# EAGLE design xyControl (EAGLE 6.3)
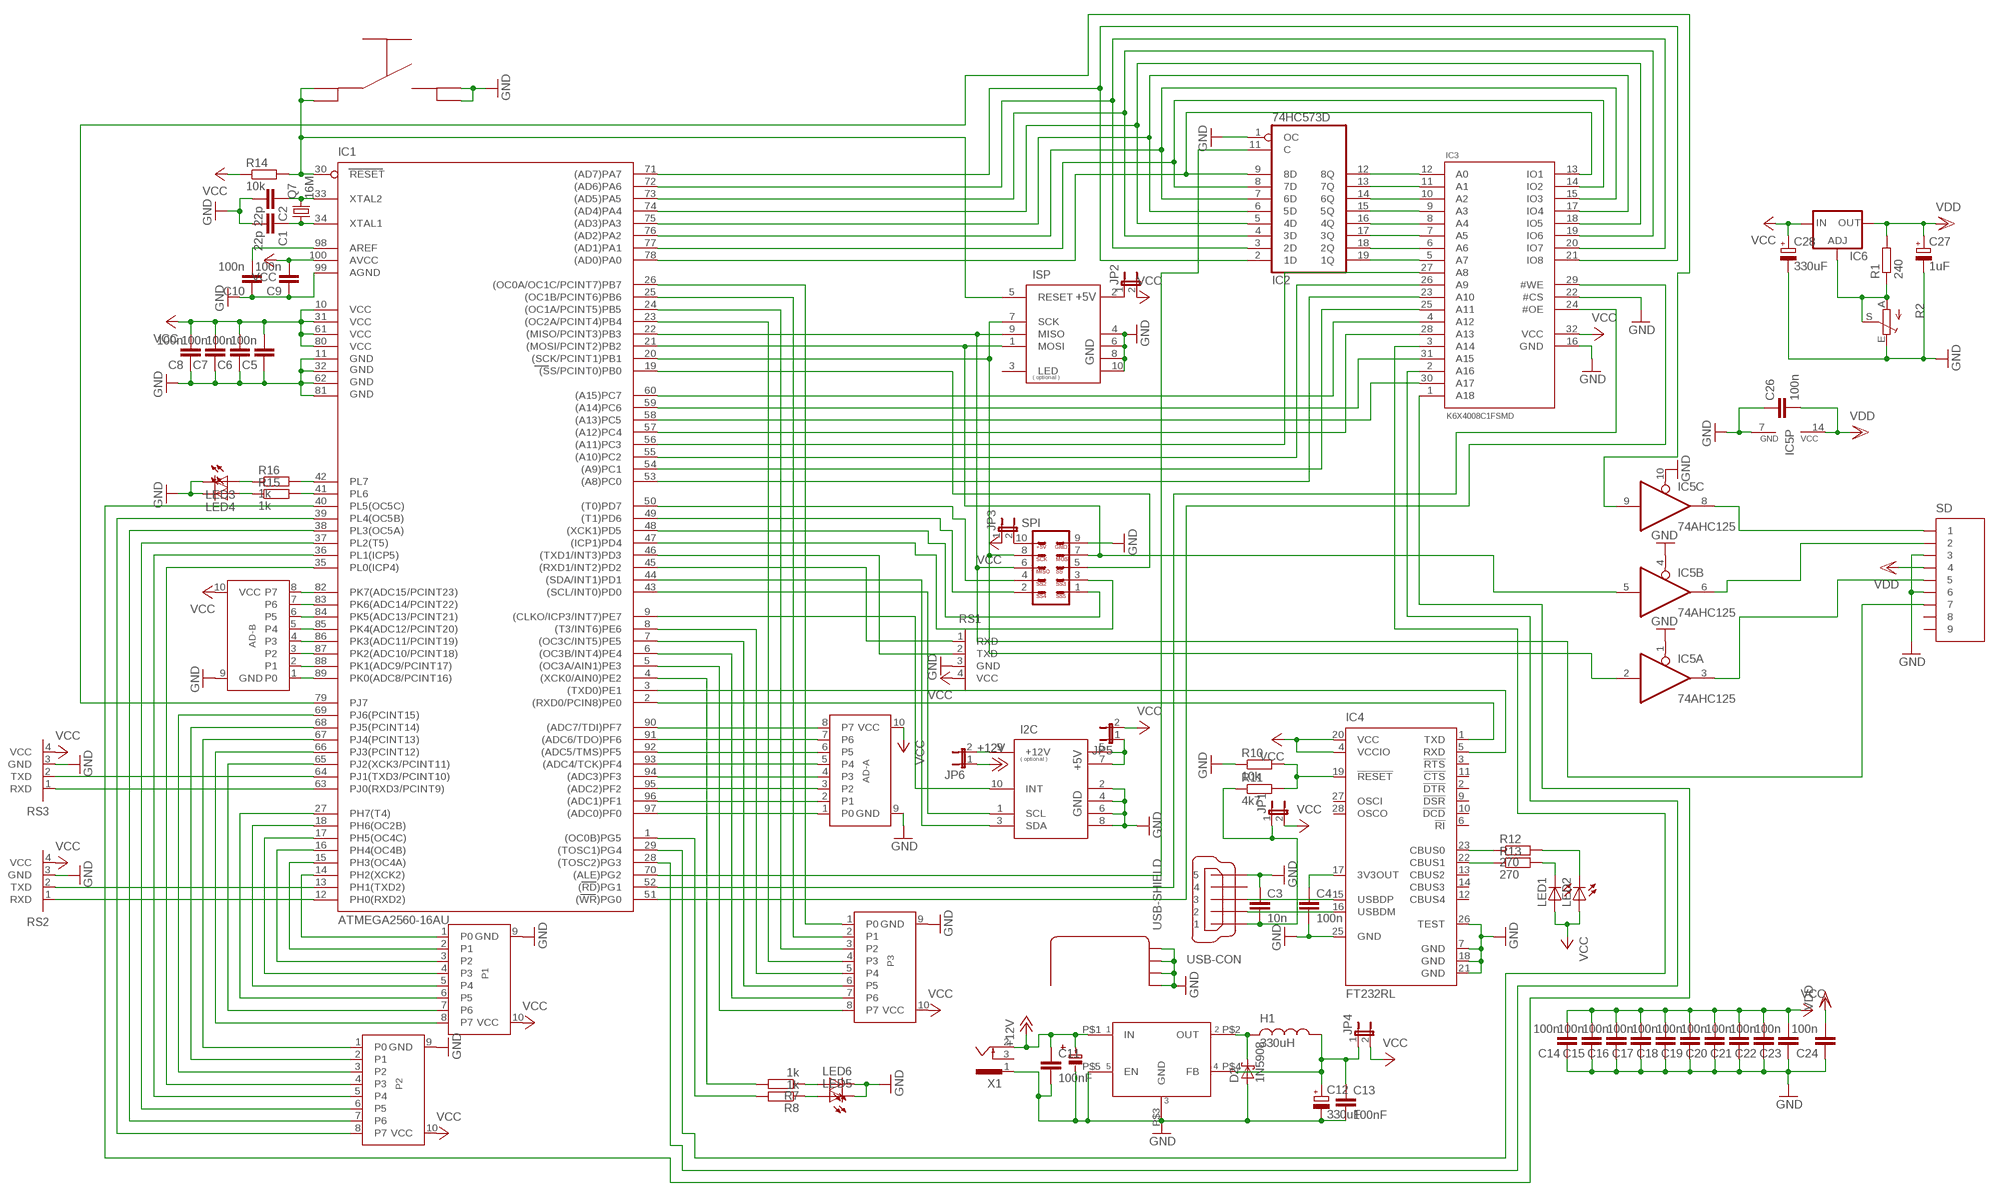
[diagram p0: schematic, sheet 1]

## Parts
AD-A  PORT  [ML10]
AD-B  PORT  [ML10]
C1  22p  C-EUC0603K  [C0603K]
C2  22p  C-EUC0603K  [C0603K]
C3  10n  C-EUC0603K  [C0603K]
C4  100n  C-EUC0603K  [C0603K]
C5  100n  C-EUC0603K  [C0603K]
C6  100n  C-EUC0603K  [C0603K]
C7  100n  C-EUC0603K  [C0603K]
C8  100n  C-EUC0603K  [C0603K]
C9  100n  C-EUC0603K  [C0603K]
C10  100n  C-EUC0603K  [C0603K]
C11  100nF  C-EUC0603K  [C0603K]
C12  330uF  CPOL-EUF  [PANASONIC_F]
C13  100nF  C-EUC0603K  [C0603K]
C14  100n  C-EUC0603K  [C0603K]
C15  100n  C-EUC0603K  [C0603K]
C16  100n  C-EUC0603K  [C0603K]
C17  100n  C-EUC0603K  [C0603K]
C18  100n  C-EUC0603K  [C0603K]
C19  100n  C-EUC0603K  [C0603K]
C20  100n  C-EUC0603K  [C0603K]
C21  100n  C-EUC0603K  [C0603K]
C22  100n  C-EUC0603K  [C0603K]
C23  100n  C-EUC0603K  [C0603K]
C24  100n  C-EUC0603K  [C0603K]
C25  100uF  ELKO  [ELKO_SMD_6.5]
C26  100n  C-EUC0603K  [C0603K]
C27  1uF  CPOL-EUE2.5-6  [E2,5-6]
C28  330uF  CPOL-EUE5-10.5  [E5-10,5]
D2  1N5908  [C4111-15]
H1  330uH  PISR_SPULE  [PISR]
I2C  I2C  [ML10]
IC1  ATMEGA2560-16AU  [TQFP100]
IC2  74HC573D  [SO20W]
IC3  K6X4008C1FSMD  [SOP-32]
IC4  FT232RL  [SSOP28]
IC5  74AHC125  74HC125D  [SO14]
IC6  LM317L  [317L]
ISP  AVR-ISP  [ML10]
JP1  JP1E  [JP1]
JP2  JP1E  [JP1]
JP3  JP1E  [JP1]
JP4  JP1E  [JP1]
JP5  JP1E  [JP1]
JP6  JP1E  [JP1]
LED1  LEDCHIP-LED0603  [CHIP-LED0603]
LED2  LEDCHIP-LED0603  [CHIP-LED0603]
LED3  LEDCHIP-LED0603  [CHIP-LED0603]
LED4  LEDCHIP-LED0603  [CHIP-LED0603]
LED5  LEDCHIP-LED0603  [CHIP-LED0603]
LED6  LEDCHIP-LED0603  [CHIP-LED0603]
LM2576-5  LM2576  [TO-220]
P1  PORT  [ML10]
P2  PORT  [ML10]
P3  PORT  [ML10]
Q7  16M  CRYSTALHC49S  [HC49/S]
R1  240  R-EU_R0603  [R0603]
R2  POT_TRIM_EU-ST10  [POT_ST10]
R7  1k  R-EU_R0603  [R0603]
R8  1k  R-EU_R0603  [R0603]
R10  10k  R-EU_R0603  [R0603]
R11  4k7  R-EU_R0603  [R0603]
R12  270  R-EU_R0603  [R0603]
R13  270  R-EU_R0603  [R0603]
R14  10k  R-EU_R0603  [R0603]
R15  1k  R-EU_R0603  [R0603]
R16  1k  R-EU_R0603  [R0603]
RS1  RS232_TTL  [1X04]
RS2  RS232_TTL  [1X04]
RS3  RS232_TTL  [1X04]
SD  FPS009-30003  [FPS009-3003]
SPI  SPISTECKER  [ML10]
T1  0-XYTHOBUZ_TASTER  [0-XYTHOBUZ_SMDTASTER]
USB  1_USER_USB-B-MINI-SMD  [1_USER_USB-B-MINI-SMD]
X1  CON-CONRAD_733980-62  [CON-CONRAD_733980-62]

## Nets
+12V: C11.1 C25.P$2 JP6.1 LM2576-5.P$1(IN) X1.2
GND: AD-A.9(GND) AD-B.9(GND) C1.2 C2.2 C3.1 C4.2 C5.1 C6.1 C7.1 C8.1 C9.1 C10.1 C11.2 C12.- C13.2 C14.1 C15.1 C16.1 C17.1 C18.1 C19.1 C20.1 C21.1 C22.1 C23.1 C24.1 C25.P$1 C26.1 C27.- C28.- D2.A I2C.2(GND) I2C.4(GND) I2C.6(GND) I2C.8(GND) IC1.11(GND) IC1.32(GND1) IC1.62(GND2) IC1.81(GND3) IC1.99(AGND) IC2.1(OC) IC3.16(GND) IC3.22(#CS) IC4.7(GND) IC4.18(GND) IC4.21(GND) IC4.25(GND) IC4.26(TEST) IC5.1(A:OE) IC5.4(B:OE) IC5.7(P:GND) IC5.10(C:OE) ISP.4(GND) ISP.6(GND) ISP.8(GND) ISP.10(GND) LED3.C LED4.C LED5.C LED6.C LM2576-5.P$3(GND) LM2576-5.P$5(EN) P1.9(GND) P2.9(GND) P3.9(GND) R2.E R10.1 RS1.3(GND) RS2.3(GND) RS3.3(GND) SD.3 SD.6 SPI.9 T1.B T1.B2 USB.5 USB.M1(-SHIELD:S1) USB.M2(-SHIELD:S2) USB.M3(-SHIELD:S3) USB.M4(-SHIELD:S4) X1.1
N$1: IC1.78((AD0)PA0) IC2.9(8D) IC3.13(IO1)
N$2: IC1.77((AD1)PA1) IC2.8(7D) IC3.14(IO2)
N$3: IC1.76((AD2)PA2) IC2.7(6D) IC3.15(IO3)
N$4: IC1.75((AD3)PA3) IC2.6(5D) IC3.17(IO4)
N$5: IC1.74((AD4)PA4) IC2.5(4D) IC3.18(IO5)
N$6: IC1.73((AD5)PA5) IC2.4(3D) IC3.19(IO6)
N$7: IC1.72((AD6)PA6) IC2.3(2D) IC3.20(IO7)
N$8: IC1.71((AD7)PA7) IC2.2(1D) IC3.21(IO8)
N$9: IC2.12(8Q) IC3.12(A0)
N$10: IC2.13(7Q) IC3.11(A1)
N$11: IC2.14(6Q) IC3.10(A2)
N$12: IC2.15(5Q) IC3.9(A3)
N$13: IC2.16(4Q) IC3.8(A4)
N$14: IC2.17(3Q) IC3.7(A5)
N$15: IC2.18(2Q) IC3.6(A6)
N$16: IC2.19(1Q) IC3.5(A7)
N$17: IC1.2((RXD0/PCIN8)PE0) IC4.1(TXD)
N$18: IC1.3((TXD0)PE1) IC4.5(RXD)
N$19: ISP.2(+5V) JP2.1
N$20: JP3.2 SPI.10
N$21: IC1.19((SS/PCINT0)PB0) SPI.5
N$22: IC1.50((T0)PD7) SPI.4
N$23: IC1.49((T1)PD6) SPI.2
N$24: IC1.48((XCK1)PD5) SPI.1
N$25: IC1.53((A8)PC0) IC3.23(A10)
N$26: IC1.54((A9)PC1) IC3.25(A11)
N$27: IC1.55((A10)PC2) IC3.26(A9)
N$28: IC1.56((A11)PC3) IC3.27(A8)
N$29: IC1.57((A12)PC4) IC3.28(A13)
N$30: IC1.58((A13)PC5) IC3.30(A17)
N$31: IC1.59((A14)PC6) IC3.31(A15)
N$32: IC1.60((A15)PC7) IC3.4(A12)
N$33: IC1.47((ICP1)PD4) SPI.3
N$34: IC1.70((ALE)PG2) IC2.11(C)
N$35: IC1.52((RD)PG1) IC3.24(#OE)
N$36: IC1.51((WR)PG0) IC3.29(#WE)
N$37: IC1.20((SCK/PCINT1)PB1) IC5.2(A:I) ISP.7(SCK) SPI.8
N$38: IC1.22((MISO/PCINT3)PB3) ISP.9(MISO) SD.7 SPI.6
N$39: IC1.21((MOSI/PCINT2)PB2) IC5.5(B:I) ISP.1(MOSI) SPI.7
N$40: IC1.30(RESET) ISP.5(RESET) R14.2 T1.A T1.A2
N$41: I2C.5(+5V) I2C.7(+5V) JP5.1
N$42: I2C.1(SCL) IC1.43((SCL/INT0)PD0)
N$43: I2C.3(SDA) IC1.44((SDA/INT1)PD1)
N$44: I2C.10(INT) IC1.9((CLKO/ICP3/INT7)PE7)
N$45: IC1.46((TXD1/INT3)PD3) RS1.2(TXD)
N$46: IC1.45((RXD1/INT2)PD2) RS1.1(RXD)
N$47: IC1.64(PJ1(TXD3/PCINT10)) RS3.2(TXD)
N$48: IC1.63(PJ0(RXD3/PCINT9)) RS3.1(RXD)
N$49: IC1.13(PH1(TXD2)) RS2.2(TXD)
N$50: IC1.12(PH0(RXD2)) RS2.1(RXD)
N$51: AD-A.8(P7) IC1.90((ADC7/TDI)PF7)
N$52: AD-A.7(P6) IC1.91((ADC6/TDO)PF6)
N$53: AD-A.6(P5) IC1.92((ADC5/TMS)PF5)
N$54: AD-A.1(P0) IC1.97((ADC0)PF0)
N$55: AD-A.2(P1) IC1.96((ADC1)PF1)
N$56: AD-A.3(P2) IC1.95((ADC2)PF2)
N$57: AD-A.4(P3) IC1.94((ADC3)PF3)
N$58: AD-A.5(P4) IC1.93((ADC4/TCK)PF4)
N$59: IC1.28((TOSC2)PG3) IC3.2(A16)
N$60: C1.1 IC1.34(XTAL1) Q7.1
N$61: AD-B.1(P0) IC1.89(PK0(ADC8/PCINT16))
N$62: AD-B.2(P1) IC1.88(PK1(ADC9/PCINT17))
N$63: AD-B.3(P2) IC1.87(PK2(ADC10/PCINT18))
N$64: AD-B.4(P3) IC1.86(PK3(ADC11/PCINT19))
N$65: AD-B.5(P4) IC1.85(PK4(ADC12/PCINT20))
N$66: AD-B.6(P5) IC1.84(PK5(ADC13/PCINT21))
N$67: AD-B.7(P6) IC1.83(PK6(ADC14/PCINT22))
N$68: AD-B.8(P7) IC1.82(PK7(ADC15/PCINT23))
N$69: IC1.29((TOSC1)PG4) IC3.3(A14)
N$70: LED6.A R7.1
N$71: LED5.A R8.1
N$72: IC4.16(USBDM) USB.2
N$73: C4.1 IC4.17(3V3OUT)
N$74: IC4.15(USBDP) USB.3
N$75: IC4.19(!RESET) R10.2 R11.2
N$76: IC1.79(PJ7) IC5.9(C:I)
N$77: IC5.3(A:O) SD.5
N$78: IC5.6(B:O) SD.2
N$79: IC5.8(C:O) SD.1
N$80: IC4.23(CBUS0) R12.1
N$81: C3.2 JP1.1 R11.1 USB.1
N$82: IC4.22(CBUS1) R13.1
N$83: IC6.1(ADJ) R1.1 R2.A R2.S
N$85: LED1.C R13.2
N$87: LED2.C R12.2
N$88: C2.1 IC1.33(XTAL2) Q7.2
N$89: D2.C H1.P$1 LM2576-5.P$2(OUT)
N$90: C12.+ C13.1 H1.P$2 JP4.1 LM2576-5.P$4(FB)
N$91: IC1.14(PH2(XCK2)) P1.1(P0)
N$92: IC1.15(PH3(OC4A)) P1.2(P1)
N$93: I2C.9(+12V) JP6.2
N$94: IC1.16(PH4(OC4B)) P1.3(P2)
N$95: C10.2 IC1.98(AREF)
N$96: IC1.17(PH5(OC4C)) P1.4(P3)
N$97: IC1.18(PH6(OC2B)) P1.5(P4)
N$98: IC1.27(PH7(T4)) P1.6(P5)
N$99: IC1.65(PJ2(XCK3/PCINT11)) P1.7(P6)
N$100: IC1.66(PJ3(PCINT12)) P1.8(P7)
N$101: IC1.67(PJ4(PCINT13)) P2.1(P0)
N$102: IC1.68(PJ5(PCINT14)) P2.2(P1)
N$103: IC1.69(PJ6(PCINT15)) P2.3(P2)
N$104: IC1.35(PL0(ICP4)) P2.4(P3)
N$105: IC1.36(PL1(ICP5)) P2.5(P4)
N$106: IC1.37(PL2(T5)) P2.6(P5)
N$107: IC1.38(PL3(OC5A)) P2.7(P6)
N$108: IC1.39(PL4(OC5B)) P2.8(P7)
N$109: IC1.40(PL5(OC5C)) IC3.1(A18)
N$110: IC1.41(PL6) R15.2
N$111: IC1.42(PL7) R16.2
N$112: LED4.A R15.1
N$113: LED3.A R16.1
N$114: IC1.1((OC0B)PG5) R8.2
N$115: IC1.4((XCK0/AIN0)PE2) R7.2
N$116: IC1.5((OC3A/AIN1)PE3) P3.8(P7)
N$117: IC1.6((OC3B/INT4)PE4) P3.7(P6)
N$118: IC1.7((OC3C/INT5)PE5) P3.6(P5)
N$119: IC1.8((T3/INT6)PE6) P3.5(P4)
N$120: IC1.23((OC2A/PCINT4)PB4) P3.4(P3)
N$121: IC1.24((OC1A/PCINT5)PB5) P3.3(P2)
N$122: IC1.25((OC1B/PCINT6)PB6) P3.2(P1)
N$123: IC1.26((OC0A/OC1C/PCINT7)PB7) P3.1(P0)
VCC: AD-A.10(VCC) AD-B.10(VCC) C5.2 C6.2 C7.2 C8.2 C9.2 C14.2 C15.2 C16.2 C17.2 C18.2 C19.2 C20.2 C21.2 C22.2 C23.2 C28.+ IC1.10(VCC) IC1.31(VCC1) IC1.61(VCC2) IC1.80(VCC3) IC1.100(AVCC) IC3.32(VCC) IC4.4(VCCIO) IC4.20(VCC) IC6.3(IN) JP1.2 JP2.2 JP3.1 JP4.2 JP5.2 LED1.A LED2.A P1.10(VCC) P2.10(VCC) P3.10(VCC) R14.1 RS1.4(VCC) RS2.4(VCC) RS3.4(VCC)
VDD: C24.2 C26.2 C27.+ IC5.14(P:VCC) IC6.2(OUT) R1.2 SD.4
Unconnected: IC4.2(!DTR) IC4.3(!RTS) IC4.6(!RI) IC4.9(!DSR) IC4.10(!DCD) IC4.11(!CTS) IC4.12(CBUS4) IC4.13(CBUS2) IC4.14(CBUS3) IC4.27(OSCI) IC4.28(OSCO) IC5.11(D:O) IC5.12(D:I) IC5.13(D:OE) ISP.3(LED) SD.8 SD.9 USB.4 X1.3

## Power pins joined to a net without a drawn wire
GND: IC2.10(GND)
VCC: IC2.20(VCC)

## Library data of the parts
AD-A AD-B P1-P3 = 01-roboternetz-definitionen:PORT: Datenportstecker Kompatibel zu den Steckern des STK500
C1-C11 C13-C24 C26 = resistor:C-EU: CAPACITOR, European symbol
C12 C27 C28 = resistor:CPOL-EU: POLARIZED CAPACITOR, European symbol
C25 = 0-xythobuz:ELKO: Elektrolyt Kondensator
D2 = diode:1N5908: DIODE schottky
H1 = 0-xythobuz:PISR_SPULE: SMD Spule/Drossel
I2C = 01-roboternetz-definitionen:I2C: I2C Bus Stecker Ein universeller serieller Bus für Erweiterungen. Der Bus hat den Vorteil das zwei Leitungen ausreichen und keine festen Taktraten und Zyklen beachtet werden müssen. Zahlreichen integrierten Schaltkreise ( wie Porterweiterungen, LCD-Treiber, usw. ) nutzen diesen Bus. Am I2C-Bus können mehrere Karten/Bausteine angeschlossen (durchgeschleift) werden, da jeder Baustein seine Slave Adresse besitzt. Der hier definierte Standard ist kompatibel ( wenn man Pin 10 unbeschaltet lässt ) zum Elektor-Standard ( Elektronik Zeitrschrift ).
IC1 = 01-atmel-2005:ATMEGA*: MICROCONTROLLER 64/128/256 Kbytes FLASH 4 Kbytes EEPROM 8 Kbytes SRAM 86 General Purpose I/O pins 12-channels16-bit PWM 4 x Serial USARTs 16-channels 10-bit A/D
IC2 = 74xx-eu:74*573: 8-bit D latch BUS DRIVER
IC3 = 00_User:K6X4008C1F
IC4 = ftdichip:FT232R: Source: http://www.ftdichip.com/Documents/DataSheets/DS_FT232R_v104.pdf; MPN: FT232RL; OC_FARNELL: 1146032; OC_NEWARK: 91K9918
IC5 = 74xx-eu:74*125: Quad bus BUFFER, 3-state
IC6 = v-reg:LM317L: VOLTAGE REGULATOR
ISP = 01-roboternetz-definitionen:AVR-ISP: ISP ( In System Programming ) Stecker für AVRs Über diesen Anschluß kann ein AVR mit einem Standard ISP-Kabel direkt an einen Parallelport des PC´s angeschlossen und programmiert werden. Die Belegung des ISP-Anschlusses ist zu dem weit verbreitetet STK200 Programmier Dongle kompatibel. Ein entsprechender Dongle ist über zahlreiche Händler lieferbar. Es gibt aber auch viele Selbstbauanleitungen im Internet.
JP1-JP6 = jumper:JP1E: JUMPER
LED1-LED6 = led:LED: LED OSRAM: - CHIPLED LG R971, LG N971, LY N971, LG Q971, LY Q971, LO R971, LY R971 LH N974, LH R974 LS Q976, LO Q976, LY Q976 LO Q996 - Hyper CHIPLED LW Q18S LB Q993, LB Q99A, LB R99A - SideLED LS A670, LO A670, LY A670, LG A670, LP A670 LB A673, LV A673, LT A673, LW A673 LH A674 LY A675 LS A676, LA A676, LO A676, LY A676, LW A676 LS A679, LY A679, LG A679 - Hyper Micro SIDELED® LS Y876, LA Y876, LO Y876, LY Y876 LT Y87S - SmartLED LW L88C, LW L88S LB L89C, LB L89S, LG L890 LS L89K, LO L89K, LY L89K LS L896, LA L896, LO L896, LY L896 - TOPLED LS T670, LO T670, LY T670, LG T670, LP T670 LSG T670, LSP T670, LSY T670, LOP T670, LYG T670 LG T671, LOG T671, LSG T671 LB T673, LV T673, LT T673, LW T673 LH T674 LS T676, LA T676, LO T676, LY T676, LB T676, LH T676, LSB T676, LW T676 LB T67C, LV T67C, LT T67C, LS T67K, LO T67K, LY T67K, LW E67C LS E67B, LA E67B, LO E67B, LY E67B, LB E67C, LV E67C, LT E67C LW T67C LS T679, LY T679, LG T679 LS T770, LO T770, LY T770, LG T770, LP T770 LB T773, LV T773, LT T773, LW T773 LH T774 LS E675, LA E675, LY E675, LS T675 LS T776, LA T776, LO T776, LY T776, LB T776 LHGB T686 LT T68C, LB T68C - Hyper Mini TOPLED® LB M676 - Mini TOPLED Santana® LG M470 LS M47K, LO M47K, LY M47K Source: http://www.osram.convergy.de LUXEON: - LUMILED® LXK2-PW12-R00, LXK2-PW12-S00, LXK2-PW14-U00, LXK2-PW14-V00 LXK2-PM12-R00, LXK2-PM12-S00, LXK2-PM14-U00 LXK2-PE12-Q00, LXK2-PE12-R00, LXK2-PE12-S00, LXK2-PE14-T00, LXK2-PE14-U00 LXK2-PB12-K00, LXK2-PB12-L00, LXK2-PB12-M00, LXK2-PB14-N00, LXK2-PB14-P00, LXK2-PB14-Q00 LXK2-PR12-L00, LXK2-PR12-M00, LXK2-PR14-Q00, LXK2-PR14-R00 LXK2-PD12-Q00, LXK2-PD12-R00, LXK2-PD12-S00 LXK2-PH12-R00, LXK2-PH12-S00 LXK2-PL12-P00, LXK2-PL12-Q00, LXK2-PL12-R00 Source: www.luxeon.com KINGBRIGHT: KA-3528ASYC Source: www.kingbright.com
LM2576-5 = 0-xythobuz:LM2576: LM2576 Schaltregler ´
Q7 = crystal:CRYSTAL: CRYSTAL; OC_FARNELL: 1667008; OC_NEWARK: unknown
R1 R7 R8 R10-R16 = resistor:R-EU_: RESISTOR, European symbol
R2 = LED_Cube:POT_TRIM_EU-: POTENTIOMETER
RS1-RS3 = 01-roboternetz-definitionen:RS232_TTL: RS232 Stecker TTL-Pegel ( für externe Pegelwandler für RS485 o.ä. )
SD = con-yamaichi:FPS009-30*: SD Card and MMC Reader (Manual Insertion) Source: http://www.yamaichi.de/pdf/c_fps009_3000.pdf; MPN: FPS009-3003-BL; OC_FARNELL: 1143953; OC_NEWARK: 91K9876
SPI = 01-robotikhardware:SPISTECKER
T1 = LED_Cube:0-XYTHOBUZ_TASTER
USB = LED_Cube:1_USER_USB-B-MINI-SMD
X1 = LED_Cube:CON-CONRAD_73398?: FEMALE PRINT CONNECTOR Niedervolt-Steckverbinder Distributor Conrad

## Board
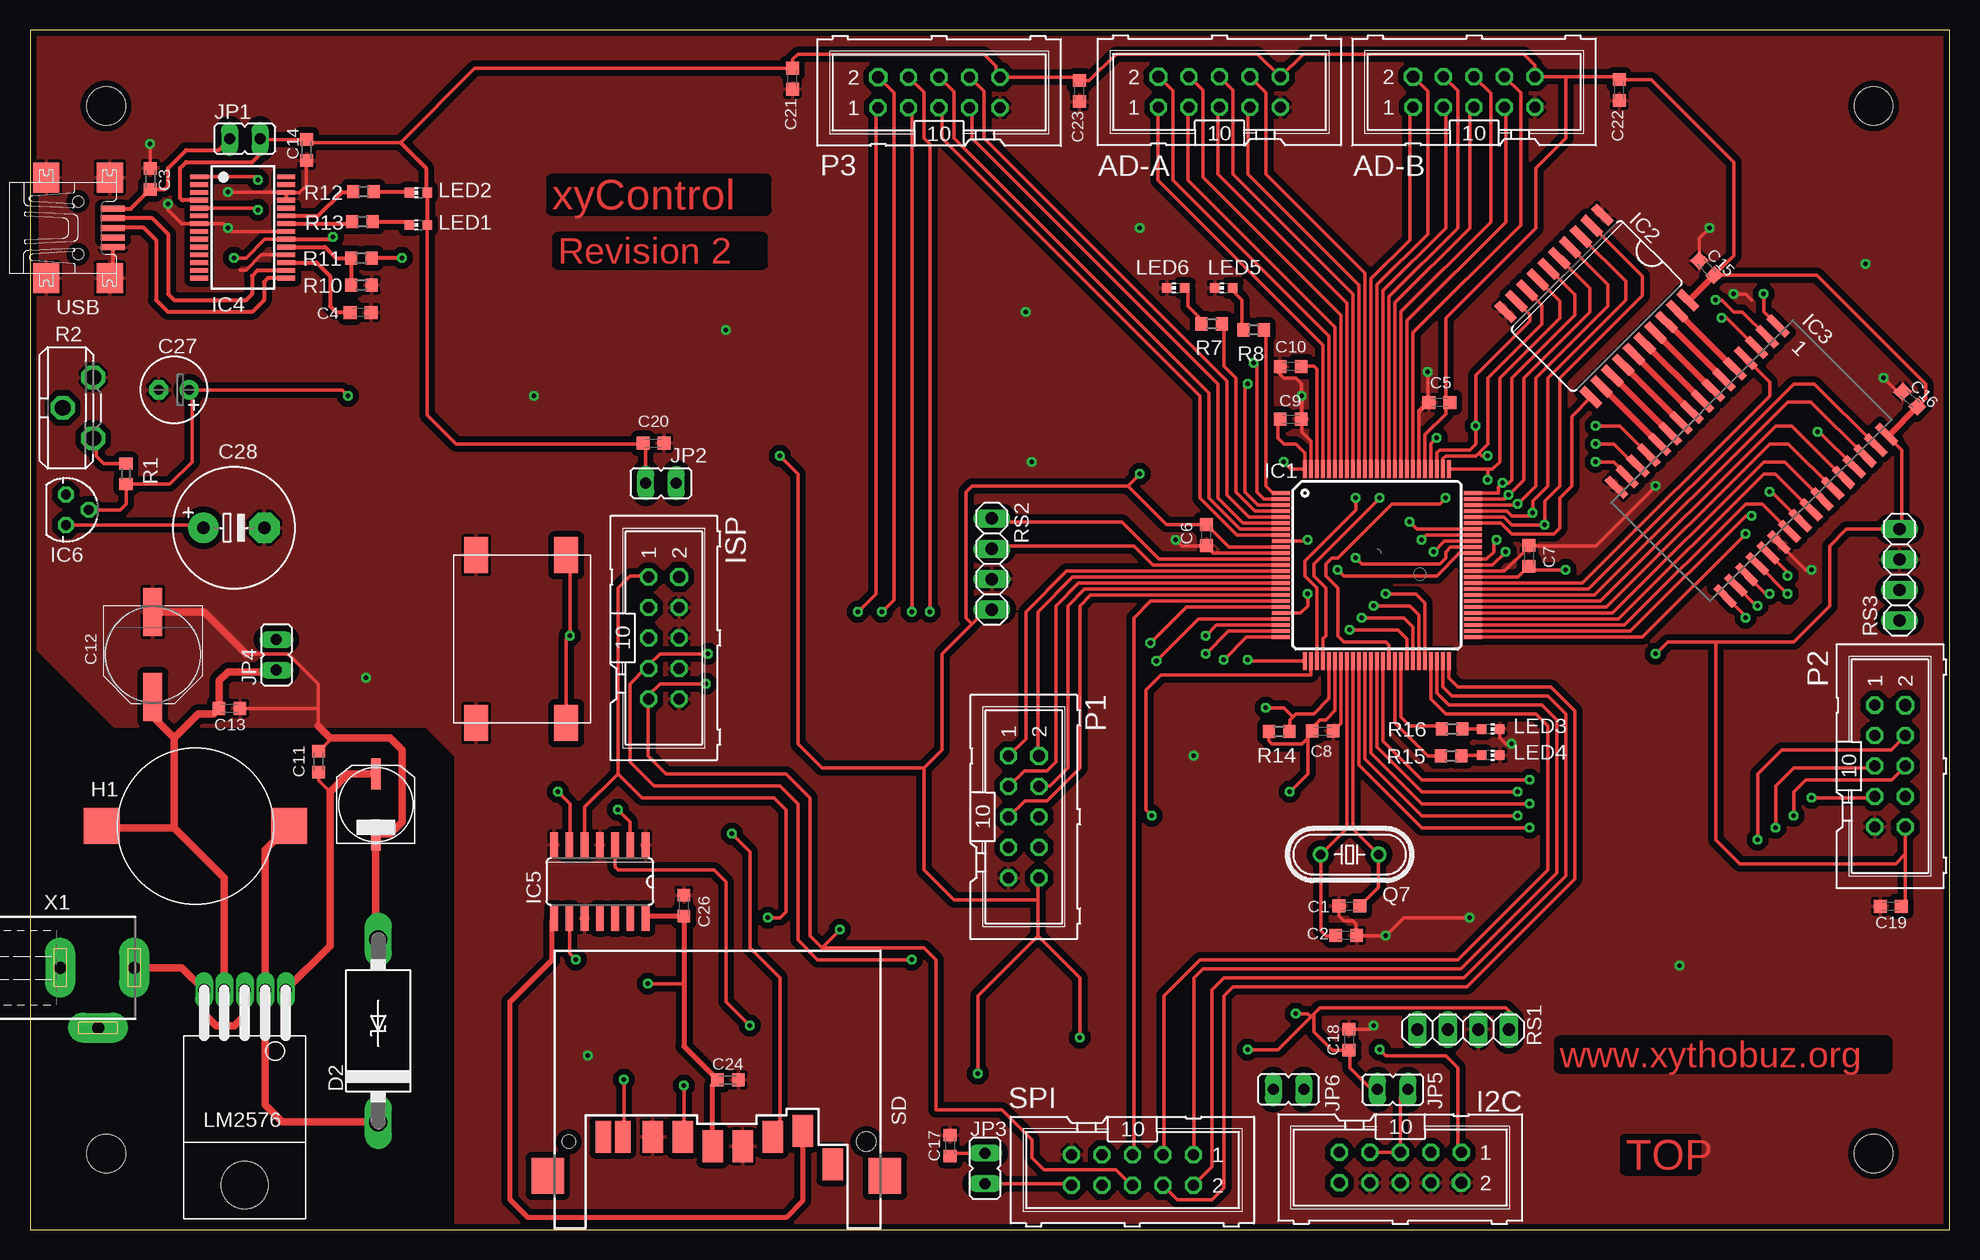
[diagram p1: board, top side]
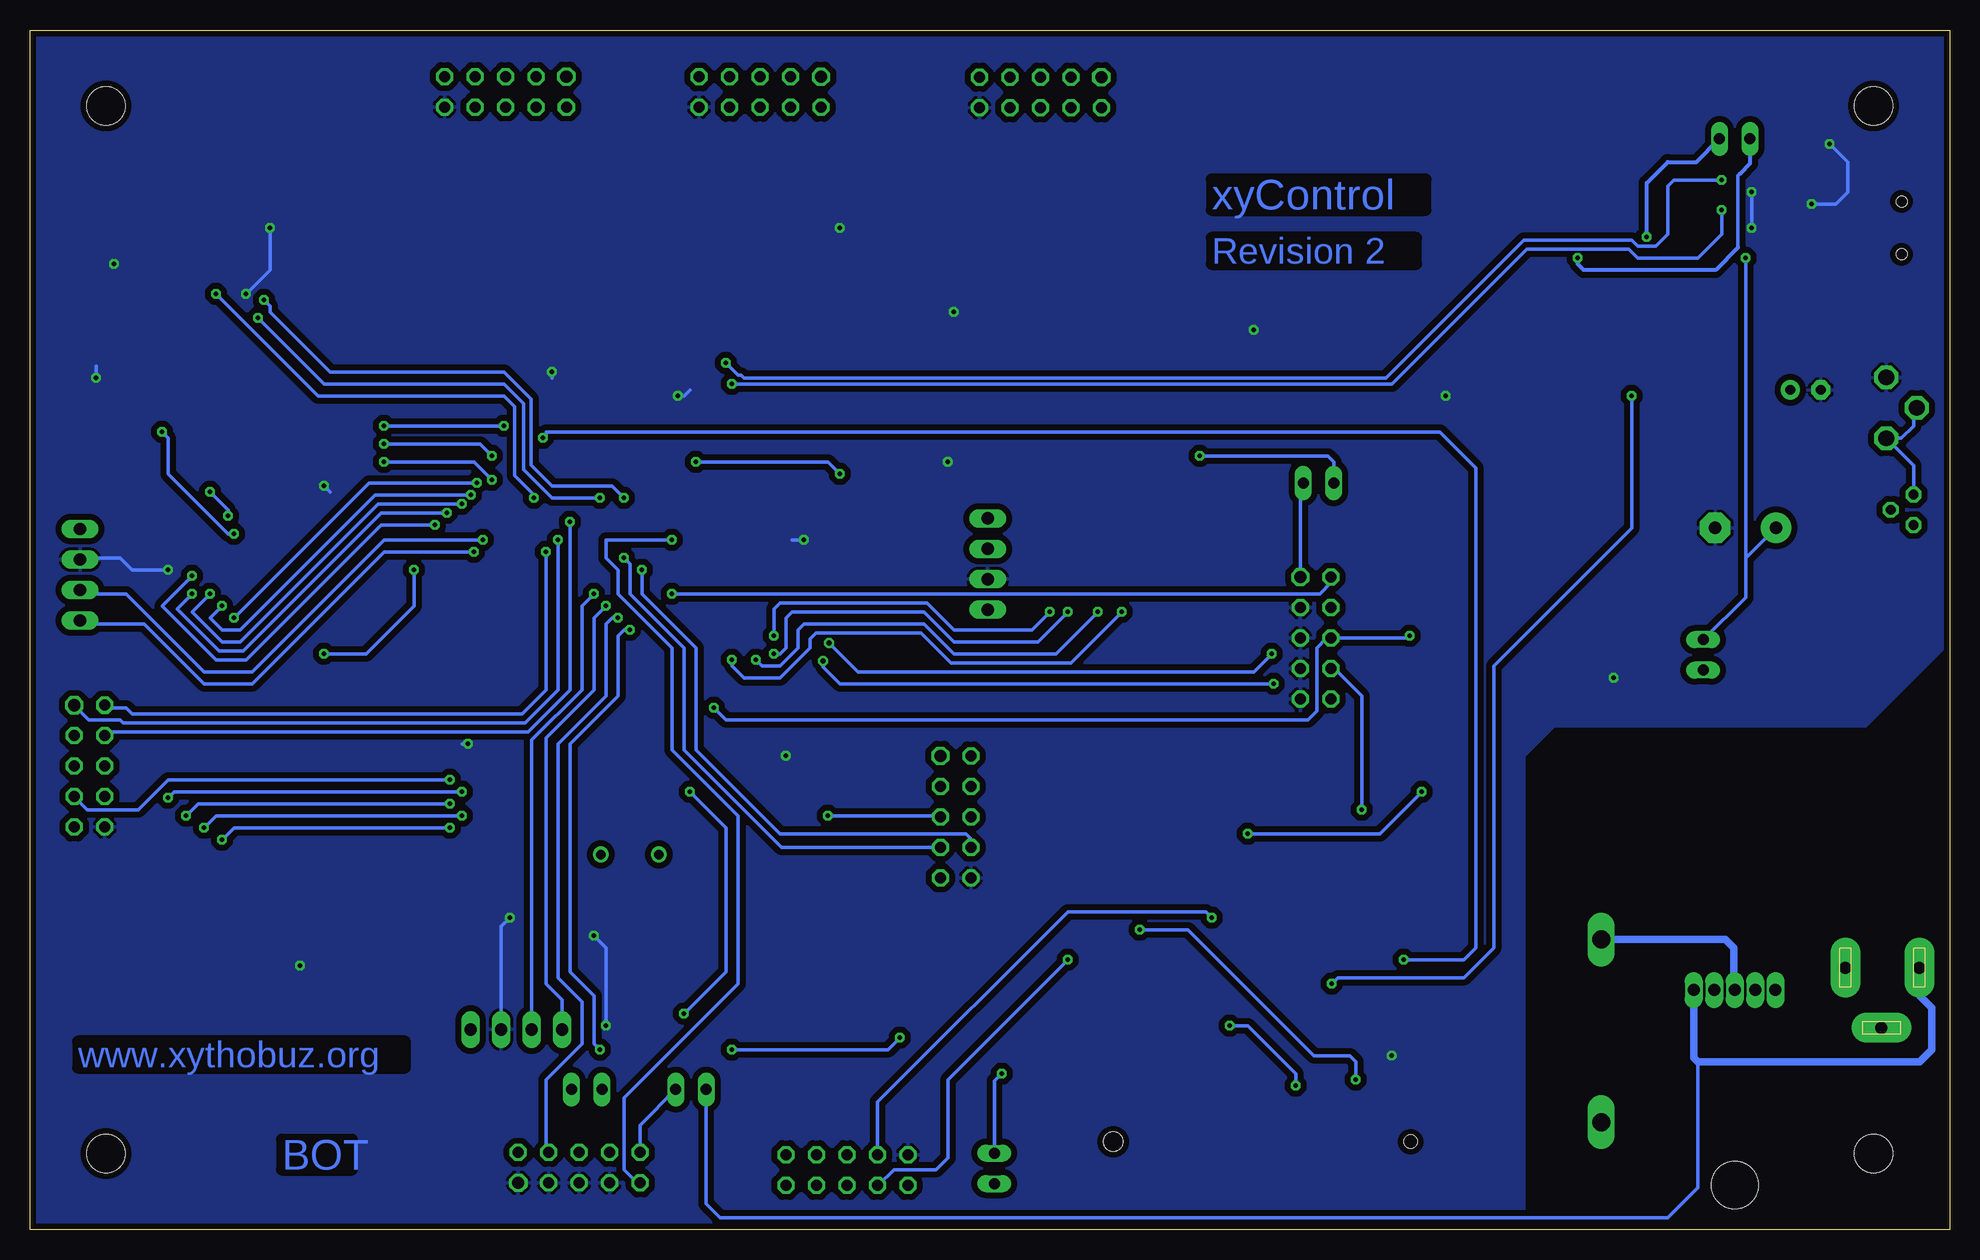
[diagram p2: board, bottom side, seen from below]

Size 160 x 100 mm. Coordinates in mm from the lower left corner, seen from the top.
Outline: 0,0 160,0 160,100 0,100 0,0
Copper layers (1*16): Top 0.035mm / dielectric 1.5mm / Bottom 0.035mm
Design rules "Fischer": minimum track width 0.15mm, minimum drill 0.3mm, track to track 0.15mm, track to pad 0.15mm, pad to pad 0.15mm, via to via 0.15mm, smd to smd 0.15mm, copper to edge 8mil, drill to drill 8mil, minimum pad ring 10mil, minimum via ring 8mil, stop-mask expansion 4mil, vias tented up to drill 0mil, thermal gap 10mil
Holes 3.2 mm at 6.35,6.35 6.35,93.65 153.65,93.65 153.65,6.35

### Footprints (pad centres in the part's own frame; a part is rotated, then mirrored left to right if it is on the bottom)
ML10 = drill 0.914 pad 1.422 octagon: 1 -5.08,-1.27; 3 -2.54,-1.27; 4 -2.54,1.27 | drill 1.016 pad 1.422 octagon: 2 -5.08,1.27 | drill 0.914 octagon: 5 0,-1.27; 6 0,1.27; 7 2.54,-1.27; 8 2.54,1.27; 9 5.08,-1.27; 10 5.08,1.27
C0603K = smd 1.05 x 1.08: 1 -0.875,0; 2 0.875,0
PANASONIC_F = smd 4 x 1.6: + 3.55,0; - -3.55,0
ELKO_SMD_6.5 = smd 2.6 x 0.8: P$1 -2.54,0; P$2 2.54,0
E2,5-6 = drill 0.813 pad 1.6: + -1.27,0 | drill 0.813 pad 1.6 octagon: - 1.27,0
E5-10,5 = drill 1.016 pad 2.54: + -2.54,0 | drill 1.016 pad 2.54 octagon: - 2.54,0
C4111-15 = drill 1.499 long: A 7.62,0; C -7.62,0
PISR = smd 3 x 3: P$1 -7.8,0; P$2 7.8,0
TQFP100 = smd 1.5 x 0.35: 1 -8,6; 2 -8,5.5; 3 -8,5; 4 -8,4.5; 5 -8,4; 6 -8,3.5; 7 -8,3; 8 -8,2.5; 9 -8,2; 10 -8,1.5; 11 -8,1; 12 -8,0.5; 13 -8,0; 14 -8,-0.5; 15 -8,-1; 16 -8,-1.5; 17 -8,-2; 18 -8,-2.5; 19 -8,-3; 20 -8,-3.5; 21 -8,-4; 22 -8,-4.5; 23 -8,-5; 24 -8,-5.5; 25 -8,-6; 51 8,-6; 52 8,-5.5; 53 8,-5; 54 8,-4.5; 55 8,-4; 56 8,-3.5; 57 8,-3; 58 8,-2.5; 59 8,-2; 60 8,-1.5; 61 8,-1; 62 8,-0.5; 63 8,0; 64 8,0.5; 65 8,1; 66 8,1.5; 67 8,2; 68 8,2.5; 69 8,3; 70 8,3.5; 71 8,4; 72 8,4.5; 73 8,5; 74 8,5.5; 75 8,6 | smd 0.35 x 1.5: 26 -6,-8; 27 -5.5,-8; 28 -5,-8; 29 -4.5,-8; 30 -4,-8; 31 -3.5,-8; 32 -3,-8; 33 -2.5,-8; 34 -2,-8; 35 -1.5,-8; 36 -1,-8; 37 -0.5,-8; 38 0,-8; 39 0.5,-8; 40 1,-8; 41 1.5,-8; 42 2,-8; 43 2.5,-8; 44 3,-8; 45 3.5,-8; 46 4,-8; 47 4.5,-8; 48 5,-8; 49 5.5,-8; 50 6,-8; 76 6,8; 77 5.5,8; 78 5,8; 79 4.5,8; 80 4,8; 81 3.5,8; 82 3,8; 83 2.5,8; 84 2,8; 85 1.5,8; 86 1,8; 87 0.5,8; 88 0,8; 89 -0.5,8; 90 -1,8; 91 -1.5,8; 92 -2,8; 93 -2.5,8; 94 -3,8; 95 -3.5,8; 96 -4,8; 97 -4.5,8; 98 -5,8; 99 -5.5,8; 100 -6,8
SO20W = smd 0.66 x 2.032: 1 -5.715,-5.029; 2 -4.445,-5.029; 3 -3.175,-5.029; 4 -1.905,-5.029; 5 -0.635,-5.029; 6 0.635,-5.029; 7 1.905,-5.029; 8 3.175,-5.029; 9 4.445,-5.029; 10 5.715,-5.029; 11 5.715,5.029; 12 4.445,5.029; 13 3.175,5.029; 14 1.905,5.029; 15 0.635,5.029; 16 -0.635,5.029; 17 -1.905,5.029; 18 -3.175,5.029; 19 -4.445,5.029; 20 -5.715,5.029
SOP-32 = smd 0.6 x 2.2: 1 -9.525,-6.4; 2 -8.255,-6.4; 3 -6.985,-6.4; 4 -5.715,-6.4; 5 -4.445,-6.4; 6 -3.175,-6.4; 7 -1.905,-6.4; 8 -0.635,-6.4; 9 0.635,-6.4; 10 1.905,-6.4; 11 3.175,-6.4; 12 4.445,-6.4; 13 5.715,-6.4; 14 6.985,-6.4; 15 8.255,-6.4; 16 9.525,-6.4; 17 9.525,6.4; 18 8.255,6.4; 19 6.985,6.4; 20 5.715,6.4; 21 4.445,6.4; 22 3.175,6.4; 23 1.905,6.4; 24 0.635,6.4; 25 -0.635,6.4; 26 -1.905,6.4; 27 -3.175,6.4; 28 -4.445,6.4; 29 -5.715,6.4; 30 -6.985,6.4; 31 -8.255,6.4; 32 -9.525,6.4
SSOP28 = smd 0.4 x 1.5: 1 -4.225,-3.625; 2 -3.575,-3.625; 3 -2.925,-3.625; 4 -2.275,-3.625; 5 -1.625,-3.625; 6 -0.975,-3.625; 7 -0.325,-3.625; 8 0.325,-3.625; 9 0.975,-3.625; 10 1.625,-3.625; 11 2.275,-3.625; 12 2.925,-3.625; 13 3.575,-3.625; 14 4.225,-3.625; 15 4.225,3.625; 16 3.575,3.625; 17 2.925,3.625; 18 2.275,3.625; 19 1.625,3.625; 20 0.975,3.625; 21 0.325,3.625; 22 -0.325,3.625; 23 -0.975,3.625; 24 -1.625,3.625; 25 -2.275,3.625; 26 -2.925,3.625; 27 -3.575,3.625; 28 -4.225,3.625
SO14 = smd 0.66 x 2.032: 1 -3.81,-3.073; 2 -2.54,-3.073; 3 -1.27,-3.073; 4 0,-3.073; 5 1.27,-3.073; 6 2.54,-3.073; 7 3.81,-3.073; 8 3.81,3.073; 9 2.54,3.073; 10 1.27,3.073; 11 0,3.073; 12 -1.27,3.073; 13 -2.54,3.073; 14 -3.81,3.073
317L = drill 0.813 octagon: 1 -1.27,0; 2 0,1.905; 3 1.27,0
JP1 = drill 0.914 long: 1 0,-1.27; 2 0,1.27
CHIP-LED0603 = smd 0.8 x 0.8: A 0,-0.75; C 0,0.75
TO-220 = drill 1 long: P$1 -3.404,-8.89; P$2 -1.702,-8.89; P$3 0,-8.89; P$4 1.702,-8.89; P$5 3.404,-8.89 | hole 3.912: 0,7.366
HC49/S = drill 0.813: 1 -2.413,0; 2 2.413,0
R0603 = smd 1 x 1.1: 1 -0.85,0; 2 0.85,0
POT_ST10 = drill 1.321 octagon: A -2.54,-1.27; E 2.54,-1.27; S 0,1.27
1X04 = drill 1.016 long: 1 -3.81,0; 2 -1.27,0; 3 1.27,0; 4 3.81,0
FPS009-3003 = smd 2.65 x 1.7: 1 -0.915,-5.3; 2 -0.415,-7.8; 3 0.385,-10.3; 4 0.385,-12.8; 5 -0.415,-15.3; 6 -0.415,-17.8; 9 1.885,-2.8 | smd 2.65 x 1.3: 7 -0.415,-20.3; 8 -0.415,-21.925 | smd 3 x 2.7: M1 2.85,1.55; M2 2.85,-26.55 | hole 1.6: 0,0 | hole 1.1: 0,-24.8
ML10' = drill 0.914 octagon: 1 -5.08,-1.27; 2 -5.08,1.27; 3 -2.54,-1.27; 4 -2.54,1.27; 5 0,-1.27; 6 0,1.27; 7 2.54,-1.27; 8 2.54,1.27; 9 5.08,-1.27; 10 5.08,1.27
0-XYTHOBUZ_SMDTASTER = smd 3 x 2: A 0,7.5; A2 14,7.5; B 0,0; B2 14,0
1_USER_USB-B-MINI-SMD = smd 2 x 0.5: 1 2.9,1.6; 2 2.9,0.8; 3 2.9,0; 4 2.9,-0.8; 5 2.9,-1.6 | smd 2.2 x 2.5: M1 -2.65,-4.2; M2 -2.65,4.2; M3 2.65,4.2; M4 2.65,-4.2 | hole 0.9: 0,2.2; 0,-2.2
CON-CONRAD_733980-62 = drill 1 pad 2.5 long: 1 0,8.57; 2 0,2.42; 3 5,5.57

### Placement (x,y rotation side)
AD-A  99.15,94.83 0 top
AD-B  120.37,94.84 0 top
C1  109.98,26.97 180 top
C2  109.71,24.53 0 top
C3  10.03,87.6 270 top
C4  27.56,76.45 0 top
C5  117.48,68.95 0 top
C6  98.05,57.9 90 top
C7  124.95,56.18 270 top
C8  107.76,41.55 180 top
C9  105.09,67.55 180 top
C10  105.08,71.95 0 top
C11  24.05,38.99 90 top
C12  10.24,47.93 270 top
C13  16.64,43.45 0 top
C14  23.05,90 90 top
C15  139.76,80.17 315 top
C16  156.71,69.22 315 top
C17  76.7,6.99 270 top
C18  109.95,15.82 270 top
C19  155.1,26.95 0 top
C20  51.98,65.55 180 top
C21  63.55,95.94 90 top
C22  132.47,94.99 90 top
C23  87.47,94.91 90 top
C24  58.17,12.47 180 top
C25  28.83,35.43 90 top
C26  54.5,27 270 top
C27  12,70 180 top
C28  17,58.5 0 top
D2  29.03,16.56 90 top
H1  13.79,33.63 180 top
I2C  114.22,5.16 180 top
IC1  112.27,55.39 0 top
IC2  130.59,76.98 225 top
IC3  143.49,64.08 225 top
IC4  17.74,83.53 270 top
IC5  47.5,29 180 top
IC6  3,60 270 top
ISP  52.84,49.31 270 top
JP1  17.9,90.92 270 top
JP2  52.6,62.23 90 top
JP3  79.62,5.1 180 top
JP4  20.53,47.9 0 top
JP5  113.6,11.68 90 top
JP6  104.9,11.67 270 top
LED1  32.37,83.75 90 top
LED2  32.37,86.44 90 top
LED3  121.75,41.72 270 top
LED4  121.75,39.53 270 top
LED5  99.5,78.5 90 top
LED6  95.5,78.5 90 top
LM2576-5  17.91,11.07 180 top
P1  82.84,34.4 270 top
P2  155.04,38.63 270 top
P3  75.78,94.79 0 top
Q7  110,31.26 180 top
R1  8,63 270 top
R2  4,68.5 90 top
R7  98.5,75.5 0 top
R8  102,75 0 top
R10  27.63,78.73 180 top
R11  27.61,80.98 180 top
R12  27.79,86.52 0 top
R13  27.71,84.02 0 top
R14  104.13,41.52 0 top
R15  118.45,39.48 180 top
R16  118.53,41.73 180 top
RS1  119.45,16.67 0 top
RS2  80.17,55.48 270 top
RS3  155.83,54.59 90 top
SD  69.71,7.32 270 top
SPI  [ML10']  91.9,4.96 180 top
T1  37.2,56.21 270 top
USB  4,83.5 0 top
X1  0.1,21.82 270 top

### Tracks (layer width: path | path; a pad name or v marks a point on that pad's centre or on a via)
+12V
  Top 0.3: C11.1 24.05,37.45 25,36.5
  Top 0.61: C25.P$2 26.47,37.97 25,36.5 25,23.65 LM2576-5.P$1
  Bottom 0.3: JP6.1 103.63,2.13 102.5,1 23.5,1 21,3.5 21,14
  Bottom 0.61: X1.2 2.52,19.52 1.5,18.5 1.5,15 2.5,14 21,14 21.31,14.31 LM2576-5.P$1
GND  (via drill 0.4)
  Top 0.3: C1.2 109.11,26.14 109.5,25.75 110.25,25.75 110.5,25.5 110.5,24.61 C2.2 110.61,24.5 v113,24.5 114.5,26 v120,26 | IC1.32 109.27,42.19 C8.1 | 106,67.52 106,66.5 106.77,65.73 IC1.99 | 106,67.52 C9.1 105.97,70.53 105.5,71 104.5,71 104,71.5 104,71.75 C10.1 | 124.5,56.5 122.89,54.89 IC1.62 | 124.5,56.5 124.5,56.6 C7.1 | C5.1 115.77,68.11 IC1.81 115.77,68.27 116.5,69 v116.5,71.5 | 25,41 25,40.81 C11.2 | C6.1 98.69,56.39 IC1.11 98.61,56.39 98,57 96,57 v95.5,57.5 | C14.1 23,89.08 23,87 22.45,86.45 IC4.26 21.32,86.5 v16.5,86.5 | v11.5,85.5 11.5,85 12.64,83.86 IC4.7 16.14,83.86 v16.5,83.5 16.8,83.2 IC4.21 | v10,90.5 10,88.5 C3.1 | C18.1 111.69,16.7 v112,17 | C15.1 139.14,82.64 v140,83.5 | v142,78 143,78 143.5,77.5 143.54,77.5 | IC3.22 145.78,57.23 148,55 v148.5,55 | 124.5,56.5 125,57 130.5,57 v135.5,62 | LED3.C 122.5,41 123,40.5 v123.5,40.5 | IC4.18 19.25,81.25 18,80 17.5,80 | 106,67.52 v106,69.5 | C16.1 155.66,69.84 v154.5,71
  Top 0.305: 18,48 21.5,48 24,45.5 24,43.5 | 24,43.5 24,42 | 28.94,33 C25.P$1 | C13.2 23.95,43.45 24,43.5
  Top 0.35: USB.5 6.9,79.55 USB.M4 | IC4.26 IC4.25
  Top 0.61: X1.1 12.65,21.82 LM2576-5.P$5 14.51,17.99 15.5,17 17,17 18,18 18,19.87 LM2576-5.P$3 | C25.P$1 28.83,24.38 D2.A | C12.- 14.52,51.48 18,48 | 24,42 25,41 30,41 31,40 31,34 30,33 28.94,33
  Bottom 0.3: v11.5,85.5 9.5,85.5 8.5,86.5 8.5,89 v10,90.5 | v16.5,83.5 v16.5,86.5 | v112,17 112,23.5 v113,24.5 | RS1.3 120.72,25.28 v120,26 | v140,83.5 140,80 v142,78 | v148.5,55 151.5,55 152.5,56 155.69,56 RS3.3 | v95.5,57.5 96.5,57.5 | v116.5,71.5 116.5,71 | v135.5,62 135,61.5 | v123.5,40.5 124,40.5 | v106,69.5 105.5,69.5 105,70 | v154.5,71 154.5,72
  Bottom 0.61: D2.A 18.68,24.18 18,23.5 18,20.05 LM2576-5.P$3
  other vias: 97,39.5 83.5,64 83,76.5 137.5,22 153,80.5 92.5,83.5 58,75 42,69.5 46.5,14.5 28,46
  pour Top (isolate 0.5): 35.5,0 35.5,39.5 33,42 7,42 0,49 0,100 160,100 160,0
  pour Bottom (isolate 0.5): 160,0 35.5,0 35.5,39.5 33,42 7,42 0,49 0,100 160,100
N$1  (via drill 0.4)
  Top 0.3: IC1.78 117.27,64.77 117.5,65 120,65 120.5,65.5 v120.5,67 120.5,71.25 125,75.75 125,76.28 IC2.9 | IC3.13 134.93,64.57 132.5,67 v130.5,67
  Bottom 0.3: v130.5,67 v120.5,67
N$2  (via drill 0.4)
  Top 0.3: IC1.77 117.77,64.27 118,64.5 120.5,64.5 120.75,64.75 | IC2.8 126,77.08 126,75.5 121.5,71 121.5,65.5 120.75,64.75 | IC3.14 133.84,63.66 132,65.5 v130.5,65.5 | v121.5,64.5 121,64.5 120.75,64.75
  Bottom 0.3: v130.5,65.5 122.5,65.5 v121.5,64.5
N$3  (via drill 0.4)
  Top 0.3: IC1.76 121.5,63.39 | 121.5,63.39 121.89,63.39 122.5,64 122.5,71 127.5,76 127.5,77.38 IC2.7 | IC3.15 133.13,62.87 132,64 v130.5,64 | v121.5,62.5 121.5,63.39
  Bottom 0.3: v130.5,64 123,64 v121.5,62.5
N$4  (via drill 0.4)
  Top 0.3: IC1.75 122.39,61.39 122.39,61.89 v122.75,62.25 123.25,62.25 123.5,62.5 123.5,71 128.75,76.25 128.75,77.92 IC2.6 | v143,51 143,51.1 IC3.17
  Bottom 0.3: v122.75,62.25 131.75,62.25 v143,51
N$5  (via drill 0.4)
  Top 0.3: IC1.74 122.89,60.89 v123.25,61.25 124.5,62.5 124.5,71 130,76.5 130,78.47 IC2.5 | v144,52 143.9,52 IC3.18
  Bottom 0.3: v123.25,61.25 131.25,61.25 142.5,50 144,50 145,51 v144,52
N$6  (via drill 0.4)
  Top 0.3: IC1.73 123.89,60.39 v124,60.5 125.5,62 125.5,71 131.5,77 131.5,78.77 IC2.4 | v145,53 144.69,53 IC3.19
  Bottom 0.3: v124,60.5 131,60.5 142.5,49 144,49 146.5,51.5 v145,53
N$7  (via drill 0.4)
  Top 0.3: IC2.3 133,79.06 133,77.5 126.5,71 126.5,62 125.25,60.75 v125.25,59.75 125,59.5 123.5,59.5 123.11,59.89 IC1.72 | v146.5,53 146.49,53 IC3.20
  Bottom 0.3: v125.25,59.75 130.75,59.75 142.25,48.25 144.25,48.25 147.75,51.75 v146.5,53
N$8  (via drill 0.4)
  Top 0.3: IC2.2 134.38,79.48 134.38,77.88 127.5,71 127.5,62 126.25,60.75 v126.25,58.75 123.5,58.75 122.86,59.39 IC1.71 | v146.5,54.5 146.5,54.78 IC3.21
  Bottom 0.3: v126.25,58.75 130.75,58.75 142,47.5 144.5,47.5 149,52 v146.5,54.5
N$9
  Top 0.5: IC3.12 IC2.12
N$10
  Top 0.5: IC3.11 IC2.13
N$11
  Top 0.5: IC3.10 IC2.14
N$12
  Top 0.5: IC3.9 IC2.15
N$13
  Top 0.5: IC3.8 IC2.16
N$14
  Top 0.5: IC3.7 IC2.17
N$15
  Top 0.5: IC3.6 IC2.18
N$16
  Top 0.5: IC3.5 IC2.19
N$17  (via drill 0.4)
  Top 0.3: IC1.2 102.86,60.89 102.25,61.5 102.25,72 v102,72.25 | IC4.1 18.75,87.75 v19,87.5
  Bottom 0.3: v102,72.25 101,71.25 100.75,71.25 100.5,71 47,71 35.5,82.5 26.5,82.5 26,82 24.5,82 23.5,83 23.5,87 23,87.5 v19,87.5
N$18  (via drill 0.4)
  Top 0.3: IC1.3 102.36,60.39 101.25,61.5 101.25,70.25 v101.5,70.5 | IC4.5 18.84,85.16 v19,85
  Bottom 0.3: v101.5,70.5 46.5,70.5 35.25,81.75 26.75,81.75 26,81 21,81 19,83 19,84.5 v19,85
N$19
  Bottom 0.3: ISP.2 54.11,61.99 JP2.1
N$20
  Top 0.3: JP3.2 86.68,3.83 SPI.10
N$21
  Top 0.3: IC1.19 93.39,52.39 92,51 92,6.33 SPI.5
N$22
  Top 0.3: IC1.50 118.27,45.98 119,45.25 126.75,45.25 128.75,43.25 128.75,29.25 119.75,20.25 100.25,20.25 99.5,19.5 99.5,3.5 98.5,2.5 95.63,2.5 SPI.4
N$23
  Top 0.3: IC1.49 117.77,45.23 118.5,44.5 126.5,44.5 128,43 128,29.5 119.5,21 99.5,21 98.5,20 98.5,5.21 SPI.2
N$24
  Top 0.3: IC1.48 117.27,44.73 118.25,43.75 126,43.75 127.25,42.5 127.25,29.75 119.25,21.75 97.75,21.75 97,21 97,6.25 SPI.1
N$25
  Top 0.3: IC1.53 132.89,50.39 143,60.5 144.38,60.5 IC3.23
N$26
  Top 0.3: IC1.54 132.39,50.89 144.5,63 145.47,63 IC3.25
N$27
  Top 0.3: IC1.55 131.89,51.39 144.5,64 146.26,64 IC3.26
N$28
  Top 0.3: IC1.56 131.39,51.89 145,65.5 146.56,65.5 IC3.27
N$29
  Top 0.3: IC1.57 130.89,52.39 145.5,67 146.86,67 IC3.28
N$30
  Top 0.3: IC1.58 130.39,52.89 146.5,69 148.45,69 IC3.30
N$31
  Top 0.3: IC1.59 129.89,53.39 147,70.5 148.75,70.5 IC3.31
N$32
  Top 0.3: IC1.60 129.39,53.89 145,69.5 145,70.65 IC3.4
N$33
  Top 0.3: IC1.47 116.77,44.23 118,43 125.5,43 126.5,42 126.5,30 119,22.5 97.5,22.5 94.5,19.5 94.5,6.29 SPI.3
N$34
  Top 0.3: IC2.11 128.5,67.78 128.5,62 127.5,61 127.5,58.5 127,58 123.5,58 122.61,58.89 IC1.70
N$35  (via drill 0.4)
  Top 0.3: IC1.52 133.39,49.89 143,59.5 v143.5,59.5 | v145,61.5 145.17,61.5 IC3.24
  Bottom 0.3: v143.5,59.5 143.5,60 v145,61.5
N$36  (via drill 0.4)
  Top 0.3: IC1.51 134.39,49.39 v143,58 | v149,66.5 149.15,66.5 IC3.29
  Bottom 0.3: v143,58 143.5,58 148.5,63 148.5,66 v149,66.5
N$37  (via drill 0.4)
  Top 0.3: IC1.20 96.39,51.89 v93.39,48.89 | v73.5,22.5 65.65,22.5 64,24.15 64,35.5 62.5,37 52,37 50,39 50,45.5 51.27,46.77 ISP.7 51.57,47.07 52.5,48 v56.5,48 | IC5.2 50.04,33.96 v49,35
  Bottom 0.3: v93.39,48.89 91,46.5 58,46.5 v56.5,48 | SPI.8 89.31,3.69 88,5 84.5,5 83.5,6 83.5,12.5 v73.5,22.5 | v49,35 49,44.5 51,46.5 51.3,46.5 ISP.7
N$38  (via drill 0.4)
  Top 0.3: IC1.22 97.39,50.89 v93.89,47.39 | SPI.6 91.81,3.69 90.5,5 84.5,5 83.5,6 83.5,7.5 81,10 75.5,10 75.5,22.5 74.5,23.5 66,23.5 | 66,23.5 65,24.5 65,36 63,38 53,38 51.5,39.5 51.5,44.16 ISP.9 51.57,44.57 52.5,45.5 v56.34,45.5 | 66,23.5 v67.5,25 | v49.5,12.5 49.5,7.83 SD.7
  Bottom 0.3: v93.89,47.39 93.89,46.89 92.5,45.5 v56.34,45.5 | v67.5,25 63.5,25 53,14.5 50,14.5 49.5,14 v49.5,12.5
N$39  (via drill 0.4)
  Top 0.3: IC1.21 105.89,51.39 106.5,52 v106.5,53 | 49,38 49,53.5 50,54.5 51.46,54.5 ISP.1 | v61.5,26 62.5,26 63,26.5 63,35 62,36 51,36 49,38 | IC5.5 46.23,35.23 49,38
  Bottom 0.3: ISP.1 51.57,53.93 52.5,53 v106.5,53 | SPI.7 89.36,10.64 73.5,26.5 62,26.5 v61.5,26
N$40  (via drill 0.4)
  Top 0.3: IC1.30 108.27,44.27 107,43 105.5,43 105.25,42.75 | 105.25,42.75 105,42.5 105,41.54 R14.2 | v103,43.5 104.5,43.5 105.25,42.75 | T1.A 45,55.91 v45,49.5 44.7,49.2 T1.A2
  Bottom 0.3: v103,43.5 102,42.5 53.5,42.5 52.75,43.25 52.75,48.5 51.94,49.31 ISP.5 45.19,49.31 v45,49.5
N$41
  Top 0.3: I2C.7 I2C.5 114.22,11.03 JP5.1
N$42  (via drill 0.4)
  Top 0.3: IC1.43 114.77,49.23 114,50 v110,50 | v112.5,15 113,14.5 118,14.5 119,13.5 119,6.73 I2C.1
  Bottom 0.3: v110,50 110.5,50 111,49.5 111,44.5 115,40.5 115,21.5 113,19.5 113,15.5 v112.5,15
N$43  (via drill 0.4)
  Top 0.3: IC1.44 115.27,50.23 114.5,51 v111,51
  Bottom 0.3: v111,51 111.5,51 112,50.5 112,44.5 116,40.5 116,21 114,19 114,15.5 117,12.5 117,6.67 I2C.3
N$44  (via drill 0.4)
  Top 0.3: IC1.9 106.39,57.39 v106.5,57.5
  Bottom 0.3: I2C.10 109.39,3.89 110.5,5 110.5,11 101,20.5 101,34.5 106.5,40 106.5,48.5 111,53 111,55 112,56 112,57.5 v106.5,57.5
N$45  (via drill 0.4)
  Top 0.3: v113,53 115.5,53 116.27,52.23 IC1.46
  Bottom 0.3: RS1.2 118.18,40.82 114,45 114,52 v113,53
N$46  (via drill 0.4)
  Top 0.3: v112,52 115,52 115.77,51.23 IC1.45
  Bottom 0.3: RS1.1 115.64,19.14 117,20.5 117,41 113,45 113,51 v112,52
N$47  (via drill 0.4)
  Top 0.3: IC1.64 121.39,55.89 122,56.5 122,57.25 v122.25,57.5
  Bottom 0.3: v122.25,57.5 130.5,57.5 141.5,46.5 145.5,46.5 152,53 155.51,53 RS3.2
N$48  (via drill 0.4)
  Top 0.3: IC1.63 121.89,55.39 v123,56.5
  Bottom 0.3: v123,56.5 130.5,56.5 141.5,45.5 145.5,45.5 150.5,50.5 155.55,50.5 RS3.1
N$49
  Top 0.3: RS2.2 80.42,57 92,57 93.61,55.39 IC1.13
N$50
  Top 0.3: RS2.1 80.46,59 91,59 94.11,55.89 IC1.12
N$51
  Top 0.3: IC1.90 111.27,79.73 103,88 103,94.79 AD-A.8
N$52
  Top 0.3: IC1.91 110.77,78.73 101.5,88 101.5,93.37 AD-A.7
N$53
  Top 0.3: IC1.92 110.27,77.98 100.25,88 100.25,95 AD-A.6
N$54
  Top 0.3: IC1.97 107.77,73.73 94,87.5 94,93.49 AD-A.1
N$55
  Top 0.3: IC1.96 108.27,74.48 95.25,87.5 95.25,94.92 AD-A.2
N$56
  Top 0.3: IC1.95 108.77,75.23 96.5,87.5 96.5,93.45 AD-A.3
N$57
  Top 0.3: IC1.94 109.27,76.23 97.75,87.75 97.75,94.96 AD-A.4
N$58
  Top 0.3: IC1.93 109.77,77.23 99,88 99,93.41 AD-A.5
N$59  (via drill 0.4)
  Top 0.3: IC1.28 107.27,53.48 106.25,54.5 106.25,55.75 110.5,60 v110.5,61 | v140.5,77.5 141,77.5 142,76.5 142.75,76.5 IC3.2
  Bottom 0.3: v110.5,61 111.5,62 116.5,62 118.25,63.75 118.25,69.25 120.5,71.5 135,71.5 140,76.5 140,77 v140.5,77.5
N$60
  Top 0.3: IC1.34 110.27,33.4 Q7.1 112.41,28.53 C1.1
N$61
  Top 0.3: IC1.89 111.77,79.27 115,82.5 115,93.28 AD-B.1
N$62
  Top 0.3: IC1.88 112.27,78.77 116.5,83 116.5,94.9 AD-B.2
N$63
  Top 0.3: IC1.87 112.77,78.27 118,83.5 118,93.4 AD-B.3
N$64
  Top 0.3: IC1.86 113.27,77.77 119,83.5 119,94.94 AD-B.4
N$65
  Top 0.3: IC1.85 113.77,77.27 120,83.5 120,93.2 AD-B.5
N$66
  Top 0.3: IC1.84 114.27,76.52 121.75,84 121.75,94.73 AD-B.6
N$67
  Top 0.3: IC1.83 114.77,75.77 123,84 123,93.48 AD-B.7
N$68
  Top 0.3: IC1.82 115.27,74.77 124.25,83.75 124.25,94.77 AD-B.8
N$69  (via drill 0.4)
  Top 0.3: IC1.29 107.77,49.27 108,49.5 108,53.5 107,54.5 107,55.5 v112.5,61 | v141,76 141.45,76 IC3.3
  Bottom 0.3: v112.5,61 116.5,61 118.88,63.38 118.88,68.88 120.5,70.5 135.5,70.5 v141,76
N$70
  Top 0.3: R7.1 97.65,75.85 96.5,77 96.5,78.25 LED6.A
N$71
  Top 0.3: LED5.A 100.25,78.25 101,77.5 101,75.15 R8.1
N$72
  Top 0.35: IC4.16 18.95,79.95 18.5,79.5 18.5,78 18,77.5 12,77.5 11.5,78 11.5,83 10.19,84.31 USB.2
N$73
  Top 0.35: IC4.17 23.89,80.61 25,79.5 25,77 25.5,76.5 26.64,76.5 C4.1
N$74
  Top 0.35: IC4.15 19.8,79.31 19.5,79 19.5,77.5 18.5,76.5 11.5,76.5 10.5,77.5 10.5,82.5 9.49,83.51 USB.3
N$75
  Top 0.3: 26.76,79 26.76,78.75 R10.2
  Top 0.35: IC4.19 24.59,81.91 25.5,81 26.74,81 R11.2 26.76,79
N$76  (via drill 0.4)
  Top 0.3: IC1.79 116.77,65.52 v117.25,66 | IC5.9 44.96,23.04 v45.5,22.5
  Bottom 0.3: v117.25,66 117,66.25 117,66.5 42.5,66.5 39.5,63.5 39.5,23.5 40.5,22.5 v45.5,22.5
N$77  (via drill 0.4)
  Top 0.3: IC5.3 48.77,30.23 49,30 57,30 58,29 58,19 v60,17 | v54.5,12 54.5,7.83 SD.5
  Bottom 0.3: v60,17 58.5,17 54.5,13 v54.5,12
N$78  (via drill 0.4)
  Top 0.3: SD.2 61.91,8.41 62.5,9 62.5,21 60,23.5 60,31.5 v58.5,33 | v44,36.5 45,35.5 45,32.11 IC5.6
  Bottom 0.3: v58.5,33 47.5,33 v44,36.5
N$79
  Top 0.406: SD.1 64.41,2.41 63,1 41.5,1 40,2.5 40,19 43.5,22.5 43.5,25.74 IC5.8
N$80
  Top 0.35: IC4.23 24,84.5 26,86.5 26.92,86.5 R12.1
N$81  (via drill 0.4)
  Top 0.35: USB.1 8.4,85.1 C3.2 11.22,86.72 11.5,87 11.5,88.5 13,90 15.71,90 JP1.1 | v31,81 28.48,81 R11.1
  Bottom 0.3: 17.63,81.87 17.63,87.87 17.5,88
  Bottom 0.35: JP1.1 16.63,88.87 17.5,88 | 17.63,81.87 19.5,80 30.5,80 31,80.5 v31,81
N$82
  Top 0.35: IC4.22 26.7,83.86 R13.1
N$83
  Top 0.3: R1.1 6.15,63.85 5.5,64.5 5.5,65.73 R2.A
  Bottom 0.3: IC6.1 3,63.69 R2.A 4.04,65.96 3,67 3,68.23 R2.S
N$85
  Top 0.35: R13.2 31.35,84.02 LED1.C
N$87
  Top 0.35: R12.2 31.54,86.52 LED2.C
N$88
  Top 0.3: IC1.33 109.77,33.44 Q7.2 107.59,24.91 108,24.5 108.81,24.5 C2.1
N$89
  Top 0.61: D2.C 28.97,9 21,9 19.61,10.39 LM2576-5.P$2 19.61,31.65 H1.P$1
N$90
  Top 0.61: LM2576-5.P$4 16.21,29.29 12,33.5 | 12,33.5 6.12,33.5 H1.P$2 | JP4.1 20.4,46.5 16.5,46.5 15.77,45.77 C13.1 15.31,43 14,43 12,41 | 12,33.5 12,41 | 12,41 10.5,42.5 10.5,44.12 C12.+
N$91
  Top 0.3: IC1.14 86.39,54.89 83,51.5 83,40.91 P1.1
N$92
  Top 0.3: IC1.15 86.89,54.39 84,51.5 84,39.59 P1.2
N$93
  Bottom 0.3: I2C.9 109.14,8.7 JP6.2
N$94
  Top 0.3: IC1.16 87.39,53.89 85.5,52 85.5,39 84.75,38.25 82.88,38.25 P1.3
N$95
  Top 0.3: IC1.98 107.27,71.73 107,72 106,72 C10.2
N$96
  Top 0.3: IC1.17 87.89,53.39 86.5,52 86.5,38.5 85,37 84.17,37 P1.4
N$97
  Top 0.3: IC1.18 88.39,52.89 87.5,52 87.5,38.5 84.75,35.75 82.92,35.75 P1.5
N$98  (via drill 0.4)
  Top 0.3: IC1.27 106.77,46.27 106.75,46.25 94.25,46.25 93,45 93,35 v93.5,34.5
  Bottom 0.3: v93.5,34.5 84.21,34.5 P1.6
N$99  (via drill 0.4)
  Top 0.3: IC1.65 119.14,56.39 117.25,54.5 109.5,54.5 v109,55
  Bottom 0.3: P1.7 81.57,32.57 82,33 97.5,33 104.5,40 104.5,48.5 109,53 v109,55
N$100  (via drill 0.4)
  Top 0.3: IC1.66 118.39,56.89 118,56.5 118,56 117.5,55.5 111,55.5 v110.5,56
  Bottom 0.3: P1.8 97.36,31.86 105.5,40 105.5,48.5 110,53 110,55.5 v110.5,56
N$101  (via drill 0.4)
  Top 0.3: IC1.67 117.89,57.39 v117,56.5
  Bottom 0.3: v117,56.5 117,45 119,43 151.5,43 152,43.5 153.56,43.5 P2.1
N$102  (via drill 0.4)
  Top 0.3: IC1.68 116.39,57.89 v116,57.5
  Bottom 0.3: v116,57.5 116,45 118.75,42.25 152.25,42.25 152.5,42.5 155.1,42.5 P2.2
N$103  (via drill 0.4)
  Top 0.3: IC1.69 115.61,58.39 v115,59
  Bottom 0.3: v115,59 115,45 118.5,41.5 153.44,41.5 P2.3
N$104  (via drill 0.4)
  Top 0.3: IC1.35 110.77,38.73 116,33.5 v125,33.5 | v144,32.5 144,38 146,40 155.14,40 P2.4
  Bottom 0.3: v125,33.5 143,33.5 v144,32.5
N$105  (via drill 0.4)
  Top 0.3: IC1.36 111.27,39.23 116,34.5 v124,34.5 | v145.5,33.5 145.5,37 147,38.5 153.64,38.5 P2.5
  Bottom 0.3: v124,34.5 144.5,34.5 v145.5,33.5
N$106  (via drill 0.4)
  Top 0.3: IC1.37 111.77,39.73 116,35.5 v125,35.5 | v147,34.5 147,36.5 148,37.5 155.18,37.5 P2.6
  Bottom 0.3: v125,35.5 146,35.5 v147,34.5
N$107  (via drill 0.4)
  Top 0.3: IC1.38 112.27,40.23 116,36.5 v124,36.5 | v148.5,36 153.68,36 P2.7
  Bottom 0.3: v124,36.5 148,36.5 v148.5,36
N$108  (via drill 0.4)
  Top 0.3: IC1.39 112.77,40.73 116,37.5 v125,37.5
  Bottom 0.3: v125,37.5 148.5,37.5 151,35 155.22,35 P2.8
N$109  (via drill 0.4)
  Top 0.3: IC1.40 113.27,48.73 113,49 109.5,49 109,49.5 109,53.5 108,54.5 108,55.5 108.5,56 109,56 113.5,60.5 117.5,60.5 v118,61 | v144.5,78 144.5,76.54 IC3.1
  Bottom 0.3: v118,61 118,61.25 119.62,62.88 119.62,68.62 120.5,69.5 136,69.5 v144.5,78
N$110
  Top 0.3: IC1.41 113.77,42.23 116.5,39.5 117.58,39.5 R15.2
N$111
  Top 0.3: IC1.42 114.27,42.73 115,42 117.41,42 R16.2
N$112
  Top 0.3: LED4.A 119.35,39.53 R15.1
N$113
  Top 0.3: LED3.A R16.1
N$114
  Top 0.3: IC1.1 103.61,61.39 103,62 103,74.85 R8.2
N$115
  Top 0.3: IC1.4 102.11,59.89 100.5,61.5 100.5,71 99.5,72 99.5,75.35 R7.2
N$116
  Top 0.3: IC1.5 101.61,59.39 99.75,61.25 99.75,70.75 79.5,91 79.5,94.88 P3.8
N$117
  Top 0.3: IC1.6 101.11,58.89 99,61 99,70.5 78.5,91 78.5,93.34 P3.7
N$118
  Top 0.3: IC1.7 100.86,58.39 98.25,61 98.25,69.75 77,91 77,94.84 P3.6
N$119
  Top 0.3: IC1.8 100.61,57.89 97.5,61 97.5,69.5 76,91 76,93.3 P3.5
N$120  (via drill 0.4)
  Top 0.3: IC1.23 98.89,50.39 v98,49.5 | v75,51.5 75,90.5 74.5,91 74.5,94.8 P3.4
  Bottom 0.3: v98,49.5 98,51.75 97.5,52.25 85.25,52.25 83,50 76.5,50 v75,51.5
N$121  (via drill 0.4)
  Top 0.3: IC1.24 99.89,49.89 v98,48 | v73.5,51.5 73.5,93.26 P3.3
  Bottom 0.3: v98,48 97.5,48 97,48.5 97,51 96.5,51.5 85.5,51.5 83,49 76,49 v73.5,51.5
N$122  (via drill 0.4)
  Top 0.3: IC1.25 101.39,49.39 v99.5,47.5 | v71,51.5 72,52.5 72,94.76 P3.2
  Bottom 0.3: v99.5,47.5 99,47 97.5,47 96,48.5 96,50 95.5,50.5 85.5,50.5 83,48 74.5,48 v71,51.5
N$123  (via drill 0.4)
  Top 0.3: IC1.26 101.61,47.39 v101.5,47.5 | v69,51.5 70.5,53 70.5,93.32 P3.1
  Bottom 0.3: v101.5,47.5 101.5,47 100.5,46 97.5,46 95,48.5 95,49.25 94.5,49.75 85.75,49.75 83.25,47.25 73.25,47.25 v69,51.5
VCC  (via drill 0.4)
  Top 0.3: 107,41.66 107,42 107.5,42.5 108,42.5 108.77,43.27 IC1.31 | 107,41.66 C8.2 106.5,41.16 106.5,41 | C9.2 104,67.33 104,66 104.5,65.5 105.5,65.5 106.27,64.73 IC1.100 105.11,63.39 v104.5,64 | R14.1 103.28,40.72 103.5,40.5 106,40.5 106.5,41 | IC1.61 124.03,54.39 C7.2 125.25,55 v128,55 | 118,68.59 118,68 116.27,66.27 IC1.80 | 118,68.59 C5.2 | 128,96.11 AD-B.10 125.45,97.05 124.5,98 106.13,98 AD-A.10 102.33,98 90.5,98 88.28,95.78 C23.2 87.19,96.06 P3.10 80.5,96.42 80.5,97 79.5,98 64,98 63.55,97.55 C21.2 37.06,96.81 30.88,90.62 23.3,90.62 C14.2 19.21,90.88 JP1.2 | 128,96.11 132.22,96.11 C22.2 135.13,95.86 142,89 142,81.17 C15.2 148.95,79.55 158,70.5 158,69.28 C16.2 | IC1.10 99.94,56.89 C6.2 94.72,58.77 91.5,62 | JP3.1 76.95,6.37 C17.2 | JP5.2 111.82,11.68 110,13.5 110,14.89 C18.2 108.56,14.95 107,16.5 107,18 | C19.2 156.31,27.29 P2.10 156.31,31.31 155.5,30.5 142.5,30.5 140.5,32.5 140.5,49 | JP2.2 51.33,65.33 C20.2 51.05,65.5 35.5,65.5 33.12,67.88 LED1.A | IC4.20 19.55,82.56 18,81 v17,81 | RS2.4 79.67,51.67 78.5,50.5 | 78.5,50.5 76,48 76,40 74.5,38.5 | 74.5,38.5 66,38.5 64,40.5 64,63 v62.5,64.5 | v79,13 79,19.5 84,24.5 | 84,24.5 84,27.5 | 84,27.5 84,29.21 P1.10 | 74.5,38.5 74.5,30 77,27.5 84,27.5 | 91.5,62 78.5,62 78,61.5 78,51 78.5,50.5 | 107,18 107.5,18.5 123,18.5 123.5,18 123.5,16.91 RS1.4 | 107,18 106.75,17.75 | 106.75,17.75 104,15 v101.5,15 | v87.5,16 87.5,21 84,24.5 | 155,66.29 155,66 156,65 156,58.57 RS3.4 151.4,58.4 150,57 150,52 147,49 140.5,49 | 140.5,49 136.5,49 v135.5,48 | 118,68.59 118,76 125.5,83.5 125.5,88.5 128,91 128,96.11 | v92.5,63 91.5,62 | 107,41.66 107,41.5 106.5,41
  Top 0.3: 106.5,41 106.5,38 v105,36.5 | v105.5,18 106.5,18 106.75,17.75 | IC6.3 14.23,58.73 C28.+
  Top 0.35: LED1.A LED2.A 33,86.56 33,88.5 30.88,90.62 | IC4.4 12.7,85.81 12.5,86 12.5,88.5 13,89 18.5,89 19,89.5 19,90.75 JP1.2 | IC4.20 25.05,82.56 v25.25,82.75
  Top 0.5: IC2.20 138.3,77.47 C15.2 | IC3.32 155,66.29 C16.2
  Bottom 0.3: v17,81 17,55.96 | JP4.2 17,52.7 17,55.96 | v62.5,64.5 51.83,64.5 51.33,64 JP2.2 | JP3.1 79.62,12.38 v79,13 | v101.5,15 88.5,15 v87.5,16 | v135.5,48 132,48 128,52 v128,55 | v104.5,64 93.5,64 v92.5,63 | v105,36.5 102,33.5 102,21.5 v105.5,18 | 17,55.96 C28.+
  Bottom 0.35: v25.25,82.75 25.25,87.25 23.5,89 21.09,89 JP1.2
VDD  (via drill 0.4)
  Top 0.3: 26.68,69.69 v26.5,69.5 26,70 C27.+ 13.5,69.77 13.5,64 11.65,62.15 R1.2 8,60.5 7.5,60 IC6.2 | v51.5,20.5 54.5,20.5
  Top 0.406: SD.4 56.91,12.09 C24.2 54.5,15.27 54.5,20.5 C26.2 51.51,26.12 IC5.14
  Bottom 0.3: v26.5,69.5 26.5,58.5 38,47 38,23.5 40.5,21 51,21 v51.5,20.5

### Text on the board
Top: xyControl | Revision 2 | www.xythobuz.org | TOP
Bottom: xyControl | Revision 2 | www.xythobuz.org | BOT